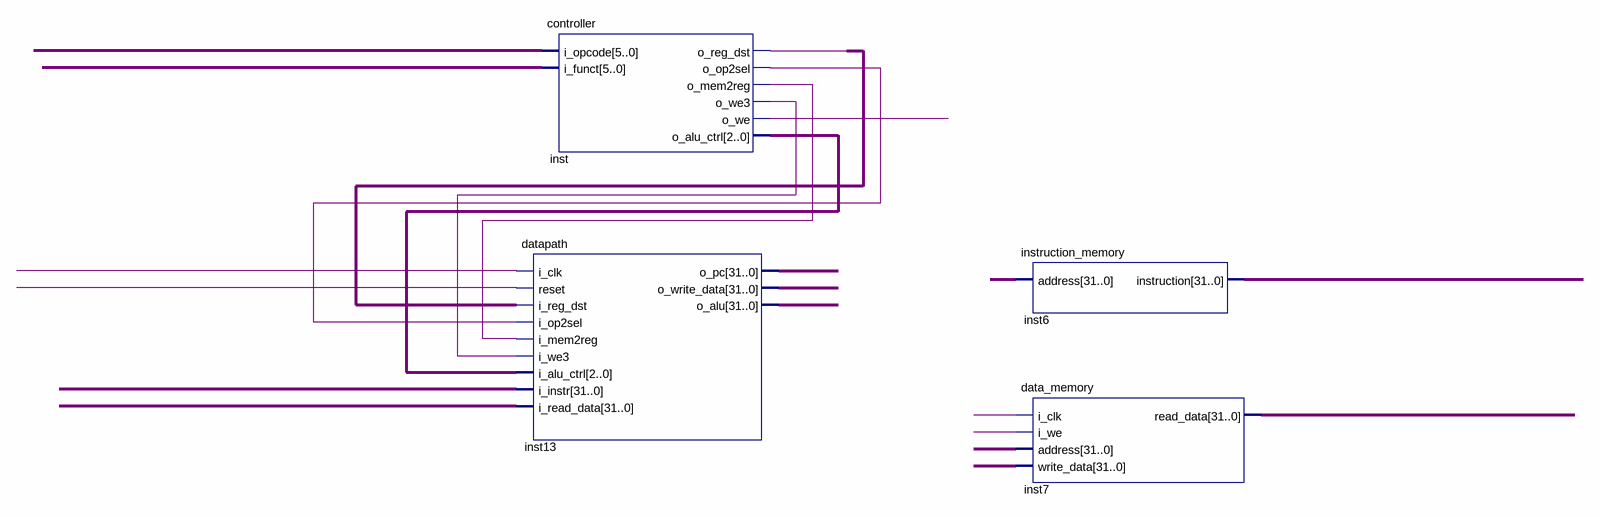
[diagram p0: schematic sheet]
// Quartus schematic mips.bdf as structural Verilog: 4 symbols, 0 pins
module mips (
);

  wire inst_o_mem2reg, inst_o_op2sel, inst_o_reg_dst, inst_o_we, inst_o_we3, undriven_5, undriven_6,
       undriven_8, undriven_9;
  wire [2:0] inst_o_alu_ctrl;
  wire [5:0] undriven_2, undriven_3;
  wire [31:0] inst6_instruction, inst7_read_data, inst13_o_alu, inst13_o_pc, inst13_o_write_data, undriven,
       undriven_4, undriven_7, undriven_10, undriven_11;

  datapath inst13 (
    .i_clk(undriven_5), .reset(undriven_6), .i_reg_dst(inst_o_reg_dst), .i_op2sel(inst_o_op2sel),
    .i_mem2reg(inst_o_mem2reg), .i_we3(inst_o_we3), .i_alu_ctrl(inst_o_alu_ctrl), .i_instr(undriven),
    .i_read_data(undriven_4), .o_pc(inst13_o_pc), .o_write_data(inst13_o_write_data), .o_alu(inst13_o_alu));
  controller inst (
    .i_opcode(undriven_3), .i_funct(undriven_2), .o_reg_dst(inst_o_reg_dst), .o_op2sel(inst_o_op2sel),
    .o_mem2reg(inst_o_mem2reg), .o_we3(inst_o_we3), .o_we(inst_o_we), .o_alu_ctrl(inst_o_alu_ctrl));
  instruction_memory inst6 (.address(undriven_7), .instruction(inst6_instruction));
  data_memory inst7 (
    .i_clk(undriven_8), .i_we(undriven_9), .address(undriven_10), .write_data(undriven_11),
    .read_data(inst7_read_data));
endmodule
